# Altium schematic sheet Sensors.SchDoc
size A
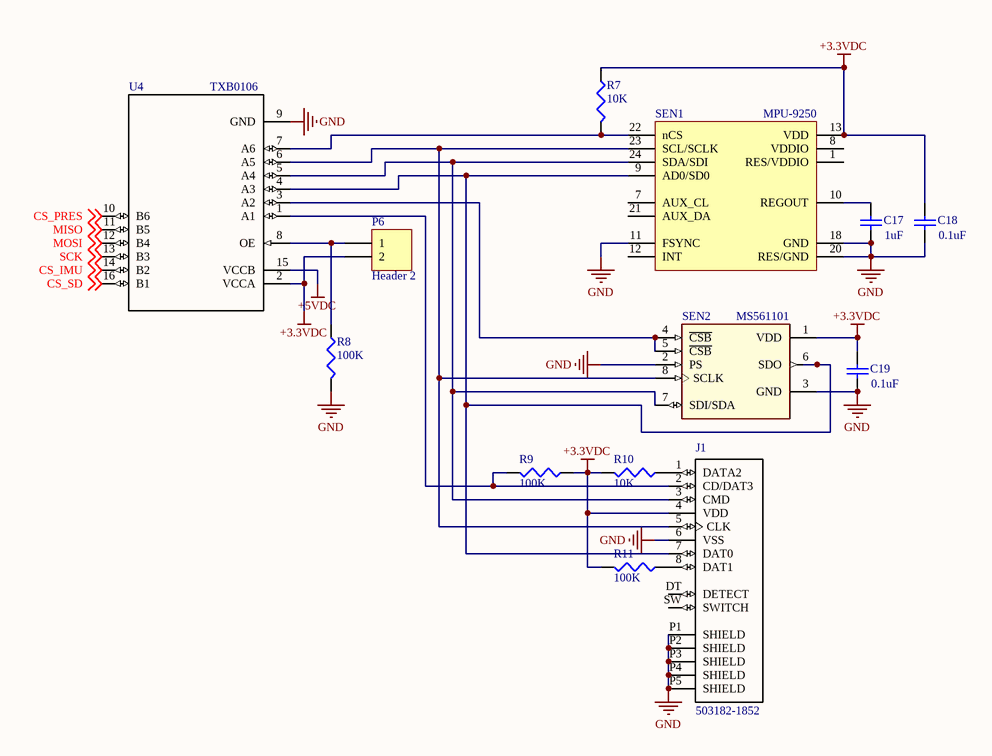
[diagram p0: Sensors.SchDoc]

## Parts
C17  value 1uF  [1608[0603]]  (hidden comment: Cap Semi)
C18  value 0.1uF  [1608[0603]]  (hidden comment: Cap Semi)
C19  value 0.1uF  [1608[0603]]  (hidden comment: Cap Semi)
J1  503182-1852  [MOLEX_503182-1852_503182-1852(Primary)]
P6  Header 2  [HDR1X2]
R7  value 10K  [J1-0603]  (hidden comment: Res3)
R8  value 100K  [J1-0603]  (hidden comment: Res3)
R9  value 100K  [J1-0603]  (hidden comment: Res3)
R10  value 10K  [J1-0603]  (hidden comment: Res3)
R11  value 100K  [J1-0603]  (hidden comment: Res3)
SEN1  MPU-9250  [QFN40P300X300X105_HS-25L]
SEN2  MS561101  [SON125P500X300X100-8N]
U4  TXB0106  [SOP65P640X120-16N]

## Nets
+3.3VDC: C18.2 C19.2 J1.4(VDD) P6.2 R7.1 R9.1 R10.2 R11.2 SEN1.13(VDD) SEN2.1(VDD) U4.2(VCCA)
+5VDC: U4.15(VCCB)
GND: C17.1 C18.1 C19.1 J1.6(VSS) J1.P1(SHIELD) J1.P2(SHIELD) J1.P3(SHIELD) J1.P4(SHIELD) J1.P5(SHIELD) R8.2 SEN1.11(FSYNC) SEN1.18(GND) SEN1.20(RES/GND) SEN2.2(PS) SEN2.3(GND) U4.9(GND)
CS_IMU: U4.14(B2) ; off-sheet CS_IMU
CS_PRES: U4.10(B6) ; off-sheet CS_PRES
CS_SD: U4.16(B1) ; off-sheet CS_SD
MISO: U4.11(B5) ; off-sheet MISO
MOSI: U4.12(B4) ; off-sheet MOSI
SCK: U4.13(B3) ; off-sheet SCK
NetC17_2: C17.2 SEN1.10(REGOUT)
NetJ1_1: J1.1(DATA2) R10.1
NetJ1_2: J1.2(CD/DAT3) R9.2 U4.1(A1)
NetJ1_3: J1.3(CMD) SEN1.24(SDA/SDI) SEN2.7(SDI/SDA) U4.5(A4)
NetJ1_5: J1.5(CLK) SEN1.23(SCL/SCLK) SEN2.8(SCLK) U4.6(A5)
NetJ1_7: J1.7(DAT0) SEN1.9(AD0/SD0) SEN2.6(SDO) U4.4(A3)
NetJ1_8: J1.8(DAT1) R11.1
NetP6_1: P6.1 R8.1 U4.8(OE)
NetR7_2: R7.2 SEN1.22(nCS) U4.7(A6)
NetSEN2_4: SEN2.4(~{CSB}) SEN2.5(~{CSB}) U4.3(A2)

Not connected (* = marked no-connect by the designer): J1 DT(DETECT) SW(SWITCH); SEN1 1(RES/VDDIO) 7(AUX_CL) 8(VDDIO) 12(INT) 21(AUX_DA)

## Library data of the parts
C17-C19 = Cap Semi: Capacitor (Semiconductor SIM Model); Published: 8-Jun-2000; LatestRevisionDate: 29-May-2009; LatestRevisionNote: IPC-7351 Footprint Added.; PackageReference: C1206; Publisher: Altium Limited; PackageDescription: Chip Capacitor
J1 = microSD Slot: Conn Micro SD Card M 8 POS 1.09mm Solder RA SMD Embossed T/R 0.5A/Contact; MF: Molex; Package: None; MP: 503182-1852; Price: None; Availability: Unavailable; SnapEDA_Link: https://www.snapeda.com/parts/503182-1852/Molex/view-part/?ref=snap; Value: *
P6 = Header 2: Header, 2-Pin; LatestRevisionDate: 17-Jul-2002; LatestRevisionNote: Re-released for DXP Platform.; Publisher: Altium Limited
R7-R11 = Res3: Resistor; Published: 8-Jun-2000; LatestRevisionDate: 29-May-2009; LatestRevisionNote: IPC-7351 Footprint Added.; PackageReference: J1-0603; Publisher: Altium Limited; PackageDescription: Chip Resistor
SEN2 = MS561101BA03-50: Pressure Sensor 1.44V to 3.6V 0.01bar to 1.2bar Absolute 8-Pin QFN T/R; MF: TE Connectivity; Price: None; Package: SMD-8 Measurement Specialties; TE_purchase_URL: https://www.te.com/usa-en/product-MS561101BA03-50.html?te_bu=Cor&te_type=disp&te_campaign=seda_glo_cor-seda-global-disp-prtnr-fy19-seda-model-bom-cta_sma-317_1&elqCampaignId=32493; SnapEDA_Link: https://www.snapeda.com/parts/MS561101BA03-50/TE%20Connectivity%20ALCOSWITCH%20Switches/view-part/?ref=snap; Availability: Unavailable; MP: MS561101BA03-50; Value: *
U4 = TXB0106PWR: 6-Bit Bidirectional Voltage-Level Translator with Auto Direction Sensing and +/-15-kV ESD Protect 16-TSSOP -40 to 85; MF: Texas Instruments; Price: None; MP: TXB0106PWR; Availability: Unavailable; SnapEDA_Link: https://www.snapeda.com/parts/TXB0106PWR/Texas%20Instruments/view-part/?ref=snap; Package: TSSOP-16 Texas Instruments; Value: *